# Altium schematic sheet proj_arhipov_reset_swd.SchDoc: =title_line_1 + title_line_2
size 420 x 297 mm; SheetNumber: 5
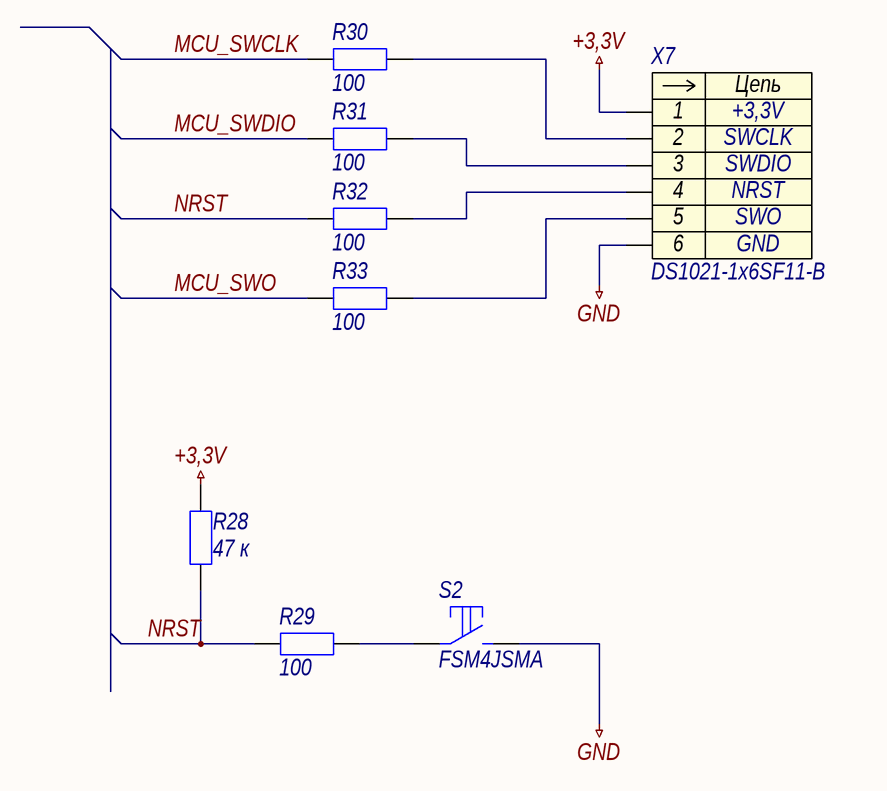
[diagram p0: proj_arhipov_reset_swd.SchDoc]

## Parts
R28  47 к  [R0603]
R29  100  [R0603]
R30  100  [R0603]
R31  100  [R0603]
R32  100  [R0603]
R33  100  [R0603]
S2  FSM4JSMA  [FSM4JSMA]
X7  DS1021-1x6SF11-B  [DS1021-1X6SF11-B]

## Nets
+3,3V: R28.2 X7.1
GND: S2.2 X7.6
MCU_SWCLK: R30.1
MCU_SWDIO: R31.1
MCU_SWO: R33.1
NRST: R28.1 R29.1 R32.1
NetR29_2: R29.2 S2.1
NetR30_2: R30.2 X7.2
NetR31_2: R31.2 X7.3
NetR32_2: R32.2 X7.4
NetR33_2: R33.2 X7.5

## Notes on the sheet
- Подп. и дата
- Инв. № дубл.
- Взам. инв. №
- Инв. № подл.
- Лист
- Изм.
- № докум.
- Подп.
- Дата
- Копировал
- Формат
- А3
- (in symbol x0016) Цепь

## Library data of the parts
R28 = r0084: =Описание; ID: r0084; Фамилия: Паньков; Описание: Резистор чип 0603 47 кОм ±1 % 0,1 Вт; Наименование: RC0603FR-0747KL; Производитель: YAGEO Corp.; Отклонение: ±1 %; Номинальное напряжение: 75 В; Номинальный ток: 1 А; Рабочие температуры: от –55 °С до +155 °С; Корпус: 0603; Примечание: Ряд E24; Номинал: 47 к; HelpURL: https://www.yageo.com/upload/media/product/productsearch/datasheet/rchip/PYu-RC_Group_51_RoHS_L_11.pdf
R29-R33 = r0007: =Описание; ID: r0007; Фамилия: Самарин; Описание: Резистор чип 0603 100 Ом ±1 % 0,1 Вт; Наименование: RC0603FR‍‐07100RL; Производитель: YAGEO Corp.; Отклонение: ±1 %; Номинальное напряжение: 75 В; Номинальный ток: 1 А; Рабочие температуры: от –55 °С до +155 °С; Корпус: 0603; Примечание: Ряд E24; Номинал: 100; HelpURL: https://www.yageo.com/upload/media/product/productsearch/datasheet/rchip/PYu-RC_Group_51_RoHS_L_11.pdf
S2 = s0001: =Описание; ID: s0001; Фамилия: Паньков; Описание: Тактовая кнопка поверхностного монтажа; Производитель: TE Connectivity; Ток нагрузки: 50 мА @ 24 В; Сопротивление контакта: 100 мОм; Количество контактов: 4; Рабочие температуры: от –35 °С до +85 °С; Промывка: Запрещена; Корпус: 6,00 x 6,00 x 4,98; Наименование: FSM4JSMA; HelpURL: https://www.te.com/usa-en/product-4-1437565-1.html
X7 = x0016: =Описание; Contact_1: +3,3V; Contact_2: SWCLK; Contact_3: SWDIO; Contact_4: NRST; Contact_5: SWO; Contact_6: GND; ID: x0016; Фамилия: Паньков; Описание: PLS 6 pin 2,54 мм вилка прямой; Производитель: Connfly Electronic Co., Ltd.; Наименование: DS1021-1x6SF11-B; HelpURL: http://en.connfly.group/product/xVkr=EusQssAN0gN=Aos=mU+UrVkR9kqEAN0gN9g+WqANB+A